# EAGLE design 8BitLFO (EAGLE 6.5.0)
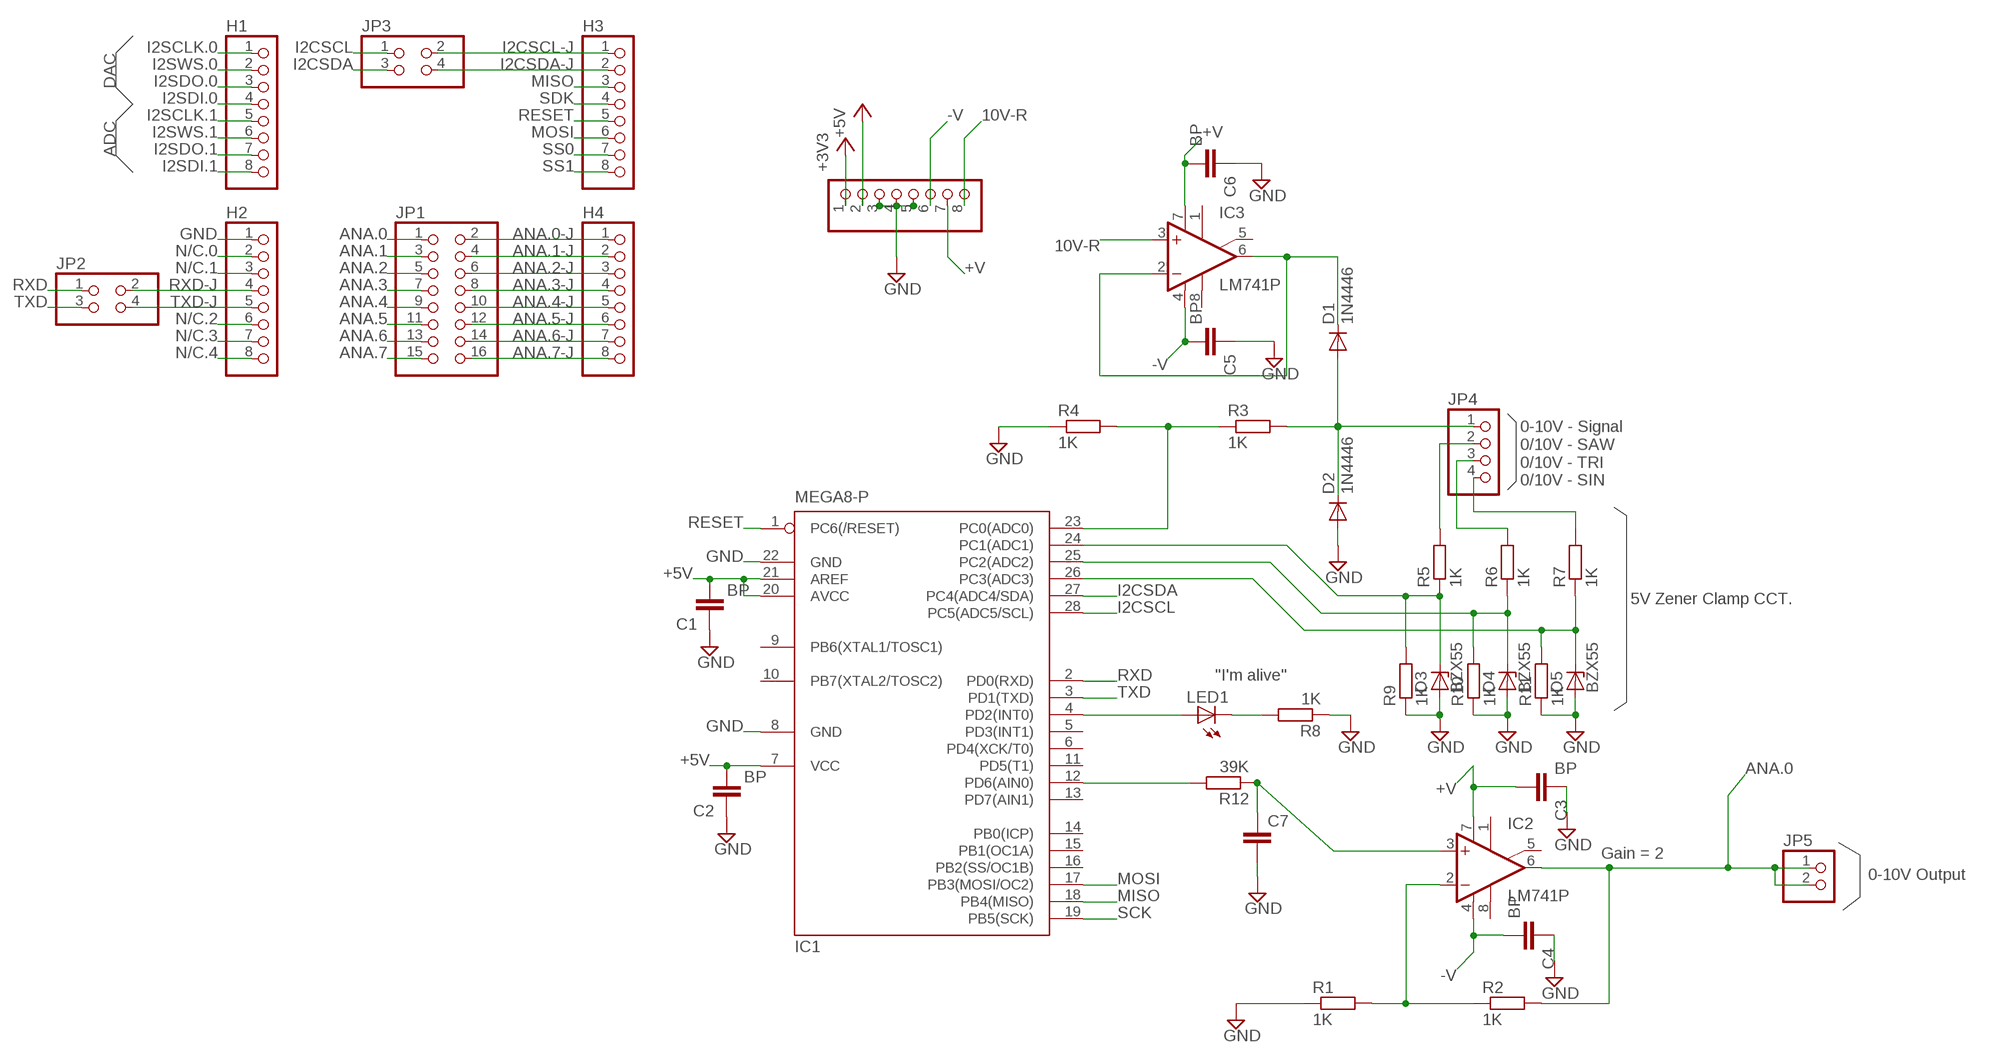
[diagram p0: schematic, sheet 1]

## Parts
C1  BP  CAPACITOR_NPOL-PTH_0.1"  [C0.1PTH]
C2  BP  CAPACITOR_NPOL-PTH_0.1"  [C0.1PTH]
C3  BP  CAPACITOR_NPOL-PTH_0.1"  [C0.1PTH]
C4  BP  CAPACITOR_NPOL-PTH_0.1"  [C0.1PTH]
C5  BP  CAPACITOR_NPOL-PTH_0.1"  [C0.1PTH]
C6  BP  CAPACITOR_NPOL-PTH_0.1"  [C0.1PTH]
C7  C7.5/3  [C7.5B3]
D1  1N4446  [DO35-10]
D2  1N4446  [DO35-10]
D3  BZX55  [DO35Z10]
D4  BZX55  [DO35Z10]
D5  BZX55  [DO35Z10]
H1  PINHD-1X8  [1X08]
H2  PINHD-1X8  [1X08]
H3  PINHD-1X8  [1X08]
H4  PINHD-1X8  [1X08]
H5  PINHD-1X8  [1X08]
IC1  MEGA8-P  [DIL28-3]
IC2  LM741P  [DIL08]
IC3  LM741P  [DIL08]
JP1  PINHD-2X8  [2X08]
JP2  PINHD-2X2  [2X02]
JP3  PINHD-2X2  [2X02]
JP4  PINHD-1X4/90  [1X04/90]
JP5  PINHD-1X2/90  [1X02/90]
LED1  LED-5MM  [LED-5MM]
R1  1K  RESISTOR-PTH-0.4  [RTH025W]
R2  1K  RESISTOR-PTH-0.4  [RTH025W]
R3  1K  RESISTOR-PTH-0.4  [RTH025W]
R4  1K  RESISTOR-PTH-0.4  [RTH025W]
R5  1K  RESISTOR-PTH-0.4  [RTH025W]
R6  1K  RESISTOR-PTH-0.4  [RTH025W]
R7  1K  RESISTOR-PTH-0.4  [RTH025W]
R8  1K  RESISTOR-PTH-0.4  [RTH025W]
R9  1K  RESISTOR-PTH-0.4  [RTH025W]
R10  1K  RESISTOR-PTH-0.4  [RTH025W]
R11  1K  RESISTOR-PTH-0.4  [RTH025W]
R12  39K  RESISTOR-PTH-0.4  [RTH025W]

## Nets
10V-R: H5.8 IC3.3(+IN)
+3V3: H5.1
+5V: C1.1 C2.1 H5.2 IC1.7(VCC) IC1.20(AVCC) IC1.21(AREF)
+V: C3.1 C6.1 H5.7 IC2.7(V+) IC3.7(V+)
-V: C4.1 C5.1 H5.6 IC2.4(V-) IC3.4(V-)
ANA.0: IC2.6(OUT) JP1.1 JP5.1 JP5.2 R2.2
ANA.0-J: H4.1 JP1.2
ANA.1: JP1.3
ANA.1-J: H4.2 JP1.4
ANA.2: JP1.5
ANA.2-J: H4.3 JP1.6
ANA.3: JP1.7
ANA.3-J: H4.4 JP1.8
ANA.4: JP1.9
ANA.4-J: H4.5 JP1.10
ANA.5: JP1.11
ANA.5-J: H4.6 JP1.12
ANA.6: JP1.13
ANA.6-J: H4.7 JP1.14
ANA.7: JP1.15
ANA.7-J: H4.8 JP1.16
GND: C1.2 C2.2 C3.2 C4.2 C5.2 C6.2 C7.2 D2.A D3.A D4.A D5.A H2.1 H5.3 H5.4 H5.5 IC1.8(GND) IC1.22(GND) R1.1 R4.1 R8.1 R9.1 R10.1 R11.1
I2CSCL: IC1.28(PC5(ADC5/SCL)) JP3.1
I2CSCL-J: H3.1 JP3.2
I2CSDA: IC1.27(PC4(ADC4/SDA)) JP3.3
I2CSDA-J: H3.2 JP3.4
I2SCLK.0: H1.1
I2SCLK.1: H1.5
I2SDI.0: H1.4
I2SDI.1: H1.8
I2SDO.0: H1.3
I2SDO.1: H1.7
I2SWS.0: H1.2
I2SWS.1: H1.6
MISO: H3.3 IC1.18(PB4(MISO))
MOSI: H3.6 IC1.17(PB3(MOSI/OC2))
N$1: IC2.2(-IN) R1.2 R2.1
N$2: D1.C IC3.2(-IN) IC3.6(OUT)
N$3: IC1.12(PD6(AIN0)) R12.2
N$4: C7.1 IC2.3(+IN) R12.1
N$5: D1.A D2.C JP4.1 R3.2
N$6: IC1.23(PC0(ADC0)) R3.1 R4.2
N$7: D3.C IC1.24(PC1(ADC1)) R5.1 R9.2
N$8: D4.C IC1.25(PC2(ADC2)) R6.1 R10.2
N$9: D5.C IC1.26(PC3(ADC3)) R7.1 R11.2
N$10: JP4.2 R5.2
N$11: JP4.3 R6.2
N$12: JP4.4 R7.2
N$14: IC1.4(PD2(INT0)) LED1.A
N$15: LED1.K(C) R8.2
N/C.0: H2.2
N/C.1: H2.3
N/C.2: H2.6
N/C.3: H2.7
N/C.4: H2.8
RESET: H3.5 IC1.1(PC6(/RESET))
RXD: IC1.2(PD0(RXD)) JP2.1
RXD-J: H2.4 JP2.2
SCK: H3.4 IC1.19(PB5(SCK))
SS0: H3.7
SS1: H3.8
TXD: IC1.3(PD1(TXD)) JP2.3
TXD-J: H2.5 JP2.4
Unconnected: IC1.5(PD3(INT1)) IC1.6(PD4(XCK/T0)) IC1.9(PB6(XTAL1/TOSC1)) IC1.10(PB7(XTAL2/TOSC2)) IC1.11(PD5(T1)) IC1.13(PD7(AIN1)) IC1.14(PB0(ICP)) IC1.15(PB1(OC1A)) IC1.16(PB2(SS/OC1B)) IC2.1(ON1) IC2.5(ON2) IC2.8(OPT) IC3.1(ON1) IC3.5(ON2) IC3.8(OPT)

## Notes on the sheet
- DAC | I2SCLK.0 | I2CSCL | I2CSCL-J
- I2SWS.0 | I2CSDA | I2CSDA-J
- I2SDO.0 | MISO
- I2SDI.0 | SDK
- ADC | I2SCLK.1 | RESET | -V | 10V-R
- I2SWS.1 | MOSI | +V
- I2SDO.1 | SS0
- I2SDI.1 | SS1
- GND | ANA.0 | ANA.0-J | 10V-R
- N/C.0 | ANA.1 | ANA.1-J
- N/C.1 | ANA.2 | ANA.2-J | +V
- RXD | RXD-J | ANA.3 | ANA.3-J
- TXD | TXD-J | ANA.4 | ANA.4-J
- N/C.2 | ANA.5 | ANA.5-J
- N/C.3 | ANA.6 | ANA.6-J
- N/C.4 | ANA.7 | ANA.7-J | -V
- 0-10V - Signal
  0/10V - SAW
  0/10V - TRI
  0/10V - SIN
- RESET
- GND
- +5V
- I2CSDA
- 5V Zener Clamp CCT.
- I2CSCL
- RXD | "I'm alive"
- TXD
- GND
- +5V
- ANA.0
- +V
- Gain = 2
- MOSI | 0-10V Output
- MISO
- SCK
- -V

## Library data of the parts
C1-C6 = dp_devices.v6:CAPACITOR_NPOL: Non-Polarized capacitor in various packages
C7 = capacitor-wima:C: CAPACITOR naming: grid - package width
D1 D2 = diode:1N4446: DIODE high speed (Philips)
D3-D5 = diode:BZX55: Z DIODE
H1-H5 = pinhead:PINHD-1X8: PIN HEADER
IC1 = atmel:MEGA8-P: MICROCONTROLLER 8 Kbytes FLASH, 1 kbytes SRAM, 512 bytes EEPROM, USART, 4-channel 10 bit ADC, 2-channel 8 bit ADC Pin compatible with Atmega48, ATMega88, ATMega168 Source: avr.lbr; OC_FARNELL: unknown; OC_NEWARK: unknown
IC2 IC3 = linear:*741: OP AMP
JP1 = pinhead:PINHD-2X8: PIN HEADER
JP2 JP3 = pinhead:PINHD-2X2: PIN HEADER
JP4 = pinhead+:PINHD-1X4: PIN HEADER
JP5 = pinhead+:PINHD-1X2: PIN HEADER
LED1 = dp_devices.v6:LED: Light Emitting Diode
R1-R12 = dp_devices.v6:RESISTOR

## Board
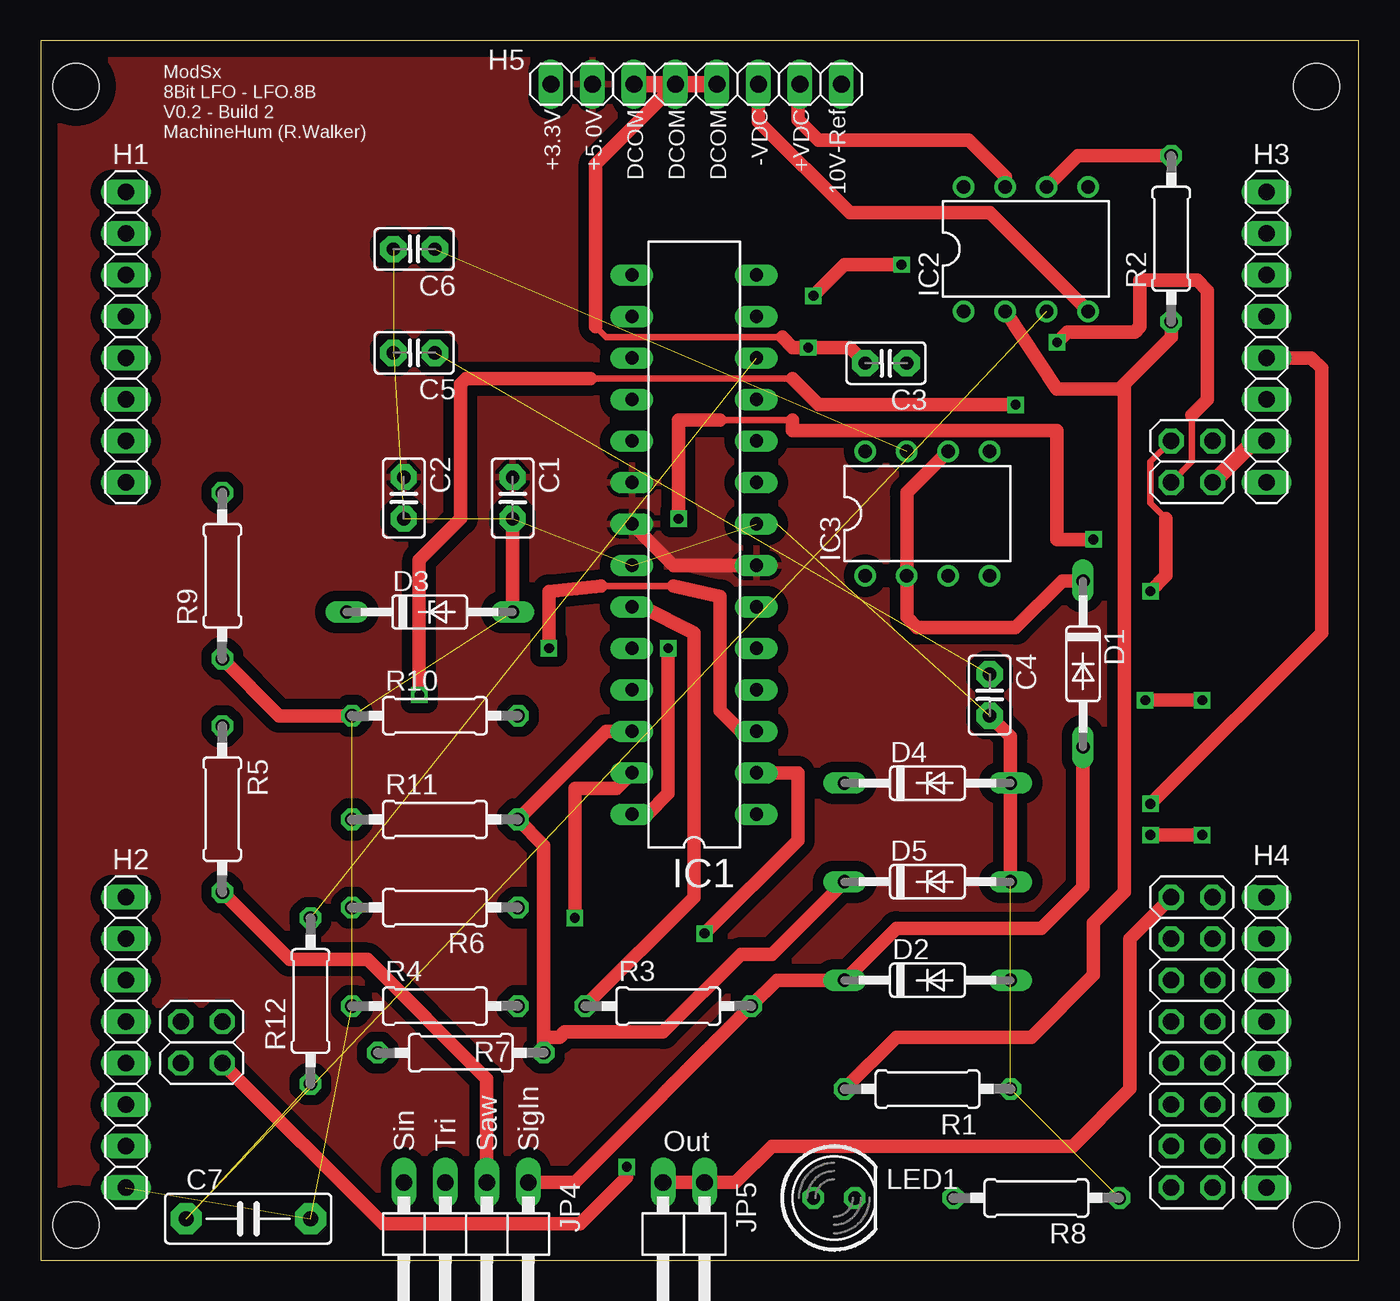
[diagram p1: board, top side]
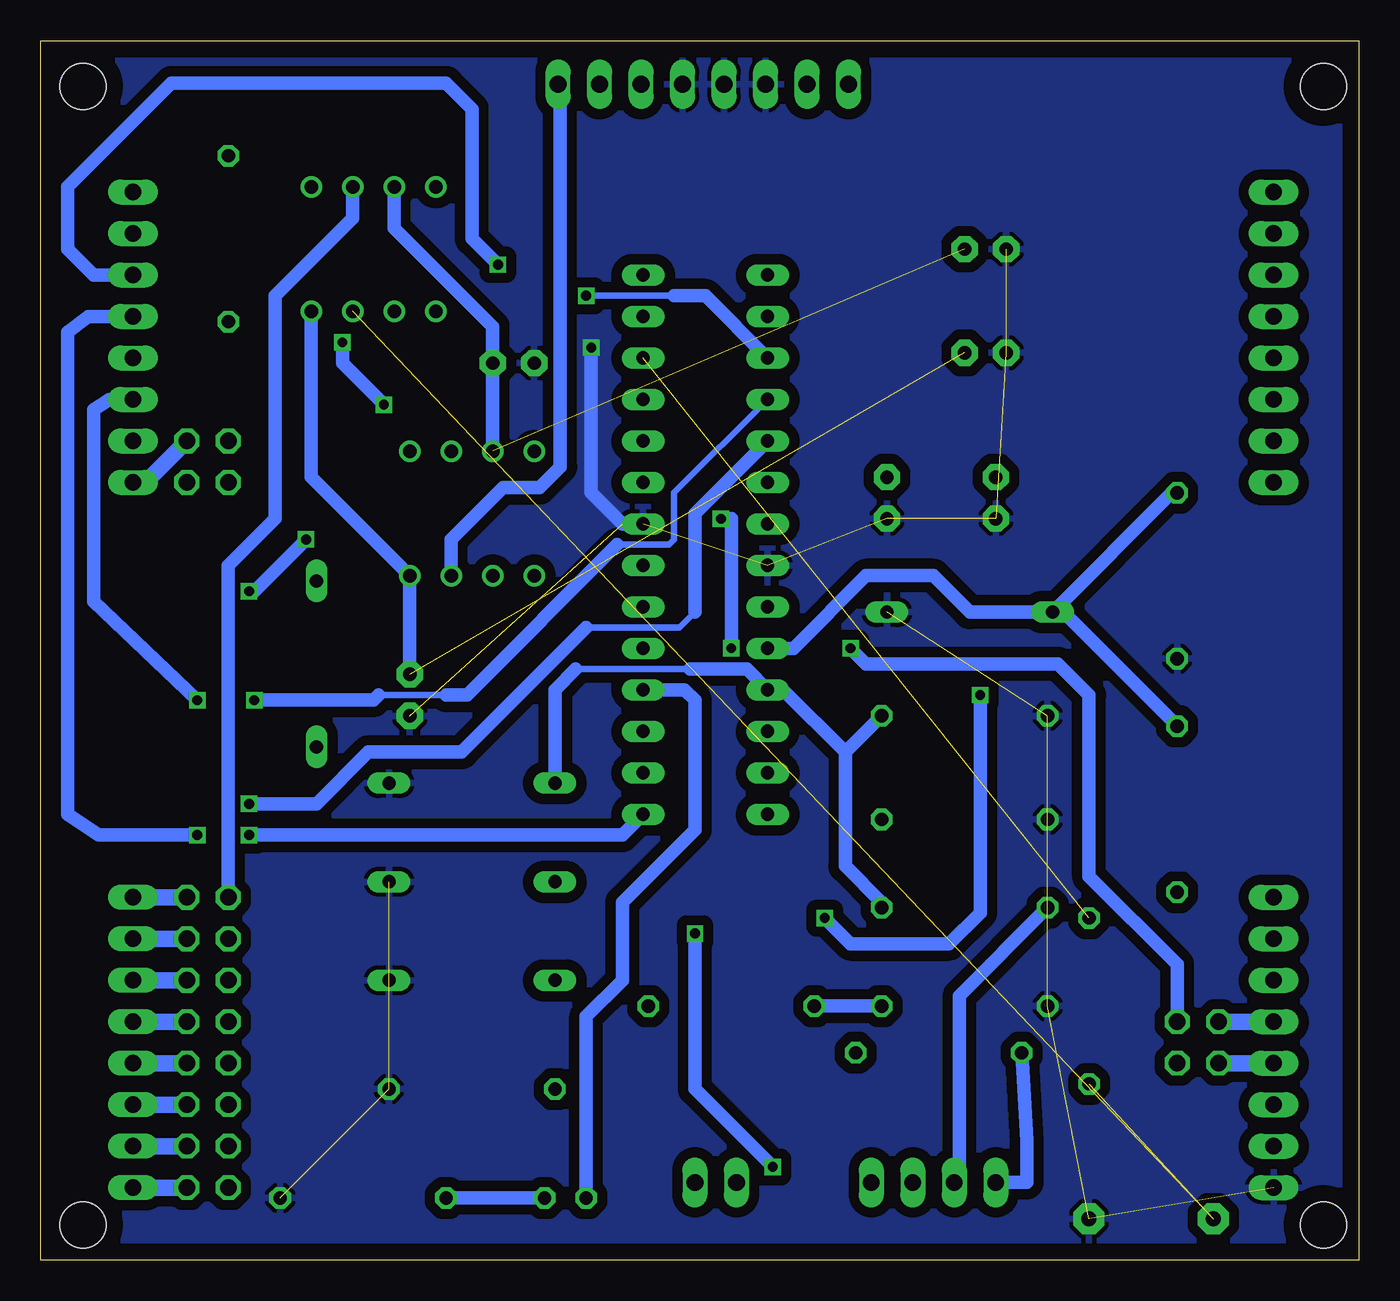
[diagram p2: board, bottom side, seen from below]

Size 80.7 x 74.67 mm. Coordinates in mm from the lower left corner, seen from the top.
Outline: 0,0 80.7,0 80.7,74.67 0,74.67 0,0
Copper layers (1*16): Top 0.035mm / dielectric 1.5mm / Bottom 0.035mm
Design rules "default": minimum track width 10mil, minimum drill 24mil, track to track 8mil, track to pad 8mil, pad to pad 8mil, via to via 8mil, smd to smd 8mil, copper to edge 40mil, drill to drill 8mil, minimum pad ring 10mil, minimum via ring 8mil, stop-mask expansion 4mil, vias tented up to drill 0mil, thermal gap 10mil
Holes 2.8 mm at 2.16,71.88 78.11,71.88 2.16,2.16 78.11,2.16

### Footprints (pad centres in the part's own frame; a part is rotated, then mirrored left to right if it is on the bottom)
C0.1PTH = drill 0.813 pad 1.6 octagon: 1 -1.27,0; 2 1.27,0
C7.5B3 = drill 0.914 pad 1.905 octagon: 1 -3.81,0; 2 3.81,0
DO35-10 = drill 0.813 long: A 5.08,0; C -5.08,0
DO35Z10 = drill 0.813 long: A 5.08,0; C -5.08,0
1X08 = drill 1.016 long: 1 -8.89,0; 2 -6.35,0; 3 -3.81,0; 4 -1.27,0; 5 1.27,0; 6 3.81,0; 7 6.35,0; 8 8.89,0
DIL28-3 = drill 0.813 long: 1 -16.51,-3.81; 2 -13.97,-3.81; 3 -11.43,-3.81; 4 -8.89,-3.81; 5 -6.35,-3.81; 6 -3.81,-3.81; 7 -1.27,-3.81; 8 1.27,-3.81; 9 3.81,-3.81; 10 6.35,-3.81; 11 8.89,-3.81; 12 11.43,-3.81; 13 13.97,-3.81; 14 16.51,-3.81; 15 16.51,3.81; 16 13.97,3.81; 17 11.43,3.81; 18 8.89,3.81; 19 6.35,3.81; 20 3.81,3.81; 21 1.27,3.81; 22 -1.27,3.81; 23 -3.81,3.81; 24 -6.35,3.81; 25 -8.89,3.81; 26 -11.43,3.81; 27 -13.97,3.81; 28 -16.51,3.81
DIL08 = drill 0.813 pad 1.27: 1 -3.81,-3.81; 2 -1.27,-3.81; 3 1.27,-3.81; 4 3.81,-3.81; 5 3.81,3.81; 6 1.27,3.81; 7 -1.27,3.81; 8 -3.81,3.81
2X08 = drill 1.016 octagon: 1 -8.89,-1.27; 2 -8.89,1.27; 3 -6.35,-1.27; 4 -6.35,1.27; 5 -3.81,-1.27; 6 -3.81,1.27; 7 -1.27,-1.27; 8 -1.27,1.27; 9 1.27,-1.27; 10 1.27,1.27; 11 3.81,-1.27; 12 3.81,1.27; 13 6.35,-1.27; 14 6.35,1.27; 15 8.89,-1.27; 16 8.89,1.27
2X02 = drill 1.016 octagon: 1 -1.27,-1.27; 2 -1.27,1.27; 3 1.27,-1.27; 4 1.27,1.27
1X04/90 = drill 1.016 long: 1 -3.81,-3.81; 2 -1.27,-3.81; 3 1.27,-3.81; 4 3.81,-3.81
1X02/90 = drill 1.016 long: 1 -1.27,-3.81; 2 1.27,-3.81
LED-5MM = drill 0.813 octagon: A -1.27,0; K 1.27,0
RTH025W = drill 0.813 octagon: 1 -5.08,0; 2 5.08,0

### Placement (x,y rotation side)
C1  28.89,46.67 270 top
C2  22.23,46.67 270 top
C3  51.75,54.93 180 top
C4  58.1,34.61 270 top
C5  22.86,55.56 180 top
C6  22.86,61.91 180 top
C7  12.7,2.54 0 top
D1  63.82,36.51 270 top
D2  54.29,17.14 0 top
D3  23.81,39.69 0 top
D4  54.29,29.21 0 top
D5  54.29,23.18 0 top
H1  5.21,56.52 90 top
H2  5.21,13.34 90 top
H3  75.06,56.52 90 top
H4  75.06,13.34 270 top
H5  40.13,72.01 0 top
IC1  40.01,43.81 90 top
IC2  60.33,61.91 0 top
IC3  54.29,45.72 0 top
JP1  70.48,13.34 270 top
JP2  9.84,13.34 90 top
JP3  70.48,48.9 270 top
JP4  26.04,0.95 180 top
JP5  39.37,0.95 180 top
LED1  48.58,3.81 0 top
R1  54.29,10.48 180 top
R2  69.22,62.55 90 top
R3  38.42,15.56 0 top
R4  24.13,15.56 0 top
R5  11.11,27.62 270 top
R6  24.13,21.59 180 top
R7  25.72,12.7 180 top
R8  60.96,3.81 180 top
R9  11.11,41.91 90 top
R10  24.13,33.34 0 top
R11  24.13,26.99 0 top
R12  16.51,15.88 90 top

### Tracks (layer width: path | path; a pad name or v marks a point on that pad's centre or on a via)
10V-R
  Bottom 0.813: IC3.3 55.56,44.13 52.39,47.31 50.16,47.31 48.9,48.58 48.9,71.88 H5.8
+5V
  Top 0.813: IC1.7 38.73,42.55 IC1.21
  pour Top (isolate 0.635): 0.32,0.32 0.32,74.3 80.33,74.3 80.33,0.32
+V  (1 unrouted)
  Top 0.813: IC2.7 59.05,66.36 56.83,68.58 47.62,68.58 46.35,69.85 46.35,71.88 H5.7
  Bottom 0.813: IC2.7 59.05,63.18 53.02,57.15 C3.1 IC3.7
-V  (1 unrouted)
  Top 0.813: IC2.4 58.1,64.14 49.53,64.14 43.94,69.72 H5.6
  Bottom 0.813: IC2.4 64.14,47.94 IC3.4 C4.1
ANA.0
  Top 0.813: JP5.2 JP5.1 42.55,4.76 44.77,6.99 63.18,6.99 66.67,10.48 66.67,19.68 JP1.1 | IC2.6 63.5,67.63 R2.2
  Bottom 0.813: JP1.1 69.22,42.55 66.36,45.4 66.36,59.05 61.59,63.82 IC2.6
ANA.0-J
  Bottom 1.016: JP1.2 H4.1
ANA.1-J
  Bottom 1.016: H4.2 JP1.4
ANA.2-J
  Bottom 1.016: JP1.6 H4.3
ANA.3-J
  Bottom 1.016: H4.4 JP1.8
ANA.4-J
  Bottom 1.016: H4.5 JP1.10
ANA.5-J
  Bottom 1.016: H4.6 JP1.12
ANA.6-J
  Bottom 1.016: H4.7 JP1.14
ANA.7-J
  Bottom 1.016: H4.8 JP1.16
GND  (via drill 0.6)  (14 unrouted)
  Top 0.406: 45.4,56.52 34.61,56.52 33.97,57.15
  Top 0.813: D3.A C1.2 | R10.1 14.61,33.34 R9.1 | C3.2 49.53,55.88 v46.99,55.88 46.04,55.88 45.4,56.52 | 33.97,57.15 33.97,67.12 H5.4 | D5.A D4.A 59.37,32.07 C4.2
  Top 1.016: H5.3 H5.4 H5.5
  Bottom 0.813: IC1.8 45.09,45.09 46.99,46.99 v46.99,55.88
  pour Bottom (isolate 0.635): 0.32,0.32 0.32,74.3 80.33,74.3 80.33,0.32
I2CSCL  (via drill 0.6)
  Top 0.406: 41.59,51.44 46.04,51.44 | 68.9,45.4 67.94,46.35 67.94,48.9 JP3.1
  Top 0.813: IC1.28 37.15,27.3 38.42,28.57 v38.42,37.47 | v39.05,45.4 39.05,51.44 41.59,51.44 | 46.04,51.44 46.04,50.8 62.23,50.8 62.23,44.13 v64.45,44.13 | v67.94,40.96 68.9,41.91 68.9,45.4
  Bottom 0.813: v38.42,37.47 38.42,45.4 v39.05,45.4 | v64.45,44.13 67.63,40.96 v67.94,40.96
I2CSCL-J
  Bottom 1.016: H3.1 74.3,47.62 JP3.2
I2CSDA  (via drill 0.6)
  Top 0.406: 33.66,53.98 46.04,53.98 | 70.48,51.75 70.48,48.9 JP3.3
  Top 0.813: IC1.27 35.24,28.89 32.7,28.89 v32.7,20.95 | v23.18,34.61 23.18,42.86 25.72,45.4 25.72,53.66 26.04,53.98 33.66,53.98 | 46.04,53.98 47.62,52.39 v59.69,52.39 | v62.23,56.2 62.87,56.83 66.99,56.83 67.31,57.15 67.31,60.01 70.8,60.01 71.44,59.37 71.44,52.7 70.48,51.75
  Bottom 0.813: v32.7,20.95 31.11,19.37 25.08,19.37 23.18,21.27 v23.18,34.61 | v59.69,52.39 62.23,54.93 v62.23,56.2
I2CSDA-J
  Top 1.016: H3.2 74.3,50.16 JP3.4
MISO  (via drill 0.6)
  Top 0.813: v71.12,34.29 v67.63,34.29
  Bottom 0.406: 60.01,34.61 55.88,34.61 | 45.4,43.81 42.23,43.81 41.91,44.13 41.91,46.99 IC1.18
  Bottom 0.813: H3.3 76.52,52.7 77.47,52.07 77.47,40.32 v71.12,34.29 | v67.63,34.29 60.33,34.29 60.01,34.61 | 55.88,34.61 54.61,34.61 45.4,43.81
MOSI  (via drill 0.6)
  Top 0.813: v47.31,59.05 49.21,60.96 v52.7,60.96
  Bottom 0.406: 41.91,59.05 v47.31,59.05
  Bottom 0.813: IC1.17 40.01,59.05 41.91,59.05 | v52.7,60.96 54.29,62.55 54.29,70.48 55.88,72.07 72.71,72.07 79.06,65.72 79.06,61.91 77.47,60.33 H3.6
N$1
  Top 0.813: IC2.2 62.23,53.34 66.04,53.34 66.36,53.66 | 66.36,53.66 69.22,56.52 R2.1 | R1.2 52.39,13.65 60.64,13.65 64.45,17.46 64.45,20.64 66.36,22.54 66.36,53.66
N$2
  Top 0.813: D1.C 62.55,41.59 59.69,38.73 53.66,38.73 53.02,39.37 IC3.2 53.02,46.99 IC3.6
N$3  (1 unrouted)
N$4  (2 unrouted)
N$5
  Top 0.813: JP4.1 32.7,4.76 R3.2 45.09,17.14 D2.C 52.39,20.32 61.28,20.32 63.82,22.86 D1.A
N$6
  Top 0.813: R3.1 40.01,22.23 40.01,38.42 36.83,40.01 IC1.23
  Bottom 0.813: R3.1 R4.2
N$7
  Bottom 0.813: R9.2 11.43,46.99 D3.C | D3.C 18.1,39.69 R5.1 | D3.C 23.81,39.69 26.04,41.91 30.16,41.91 34.61,37.47 IC1.24
N$8
  Bottom 0.406: 40.96,36.2 47.94,36.2
  Bottom 0.813: R10.2 31.43,31.11 | 31.43,31.11 31.43,24.13 29.21,21.91 R6.1 | 31.43,31.11 35.24,34.92 IC1.25 37.47,36.2 40.96,36.2 | 47.94,36.2 49.21,34.92 D4.C
N$9
  Top 0.813: IC1.26 34.61,32.38 R11.2 30.8,25.4 30.8,13.65 | 30.8,13.65 R7.1 | D5.C 44.77,18.73 42.86,18.73 38.1,13.97 32.07,13.97 31.75,13.65 30.8,13.65
N$10
  Top 0.813: JP4.2 27.3,11.11 20,18.41 15.24,18.41 R5.2
N$11
  Bottom 0.813: JP4.3 24.45,5.08 24.45,16.19 R6.2
N$12
  Bottom 0.813: JP4.4 20.32,4.76 20.32,7.3 R7.2
N$14
  Bottom 0.813: LED1.A 47.31,14.92 45.09,17.14 45.09,21.91 40.64,26.35 40.64,34.29 41.27,34.92 IC1.4
N$15
  Bottom 0.813: LED1.K R8.2
RESET  (via drill 0.6)
  Top 0.813: v71.12,26.04 v67.94,26.04
  Bottom 0.813: H3.5 77.79,57.78 79.06,56.83 79.06,27.3 77.15,26.04 v71.12,26.04 | v67.94,26.04 45.09,26.04 IC1.1
RXD  (via drill 0.6)
  Top 0.813: JP2.1 20.95,2.22 33.02,2.22 35.88,5.08 v35.88,5.71 | v40.64,20 46.35,25.72 46.35,29.84 IC1.2
  Bottom 0.813: v35.88,5.71 40.64,10.48 v40.64,20
RXD-J
  Bottom 1.016: JP2.2 H2.4
SCK  (via drill 0.6)
  Top 0.813: H3.4 77.79,55.24 78.42,54.61 78.42,38.42 v67.94,27.94
  Bottom 0.406: 47.31,38.73 41.59,38.73 40.64,39.69
  Bottom 0.813: v67.94,27.94 63.82,27.94 60.64,31.11 54.93,31.11 47.31,38.73 | 40.64,39.69 40.64,45.72 IC1.19
TXD  (via drill 0.6)
  Top 0.406: 34.29,41.27 38.73,41.27
  Top 0.813: v31.11,37.47 31.11,40.96 34.29,41.27 | 38.73,41.27 41.59,40.64 41.59,33.66 42.86,32.38 IC1.3
  Bottom 0.813: JP2.3 11.11,18.1 16.51,23.5 16.51,34.61 18.41,36.51 30.16,36.51 v31.11,37.47
TXD-J
  Bottom 1.016: JP2.4 H2.5

### Text on the board
tPlace: +3.3V | +5.0V | DCOM | DCOM | DCOM | -VDC | +VDC | 10V-Ref | ModSx / 8Bit LFO - LFO.8B / V0.2 - Build 2 / MachineHum (R.Walker) | Sin | Tri | Saw | SigIn | Out